# EAGLE design board (EAGLE 7.3.0)
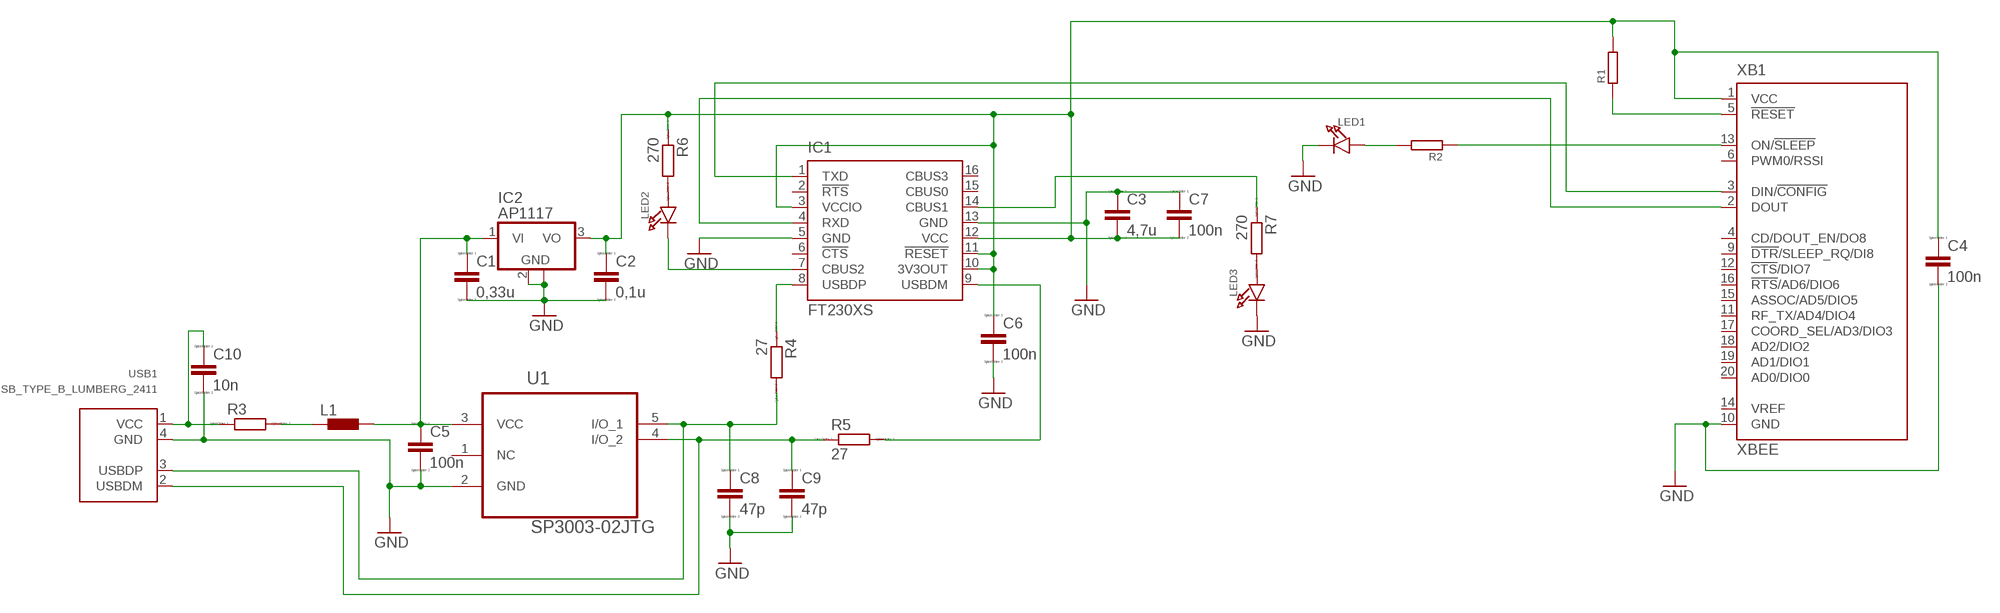
[diagram p0: schematic, sheet 1]

## Parts
C1  0,33u  C-EUC0805K  [C0805K]
C2  0,1u  C-EUC0805K  [C0805K]
C3  4,7u  C-EUC0805K  [C0805K]
C4  100n  C-EUC0805K  [C0805K]
C5  100n  C-EUC0805K  [C0805K]
C6  100n  C-EUC0805K  [C0805K]
C7  100n  C-EUC0805K  [C0805K]
C8  47p  C-EUC0805K  [C0805K]
C9  47p  C-EUC0805K  [C0805K]
C10  10n  C-EUC0805K  [C0805K]
IC1  FT230XS  [SSOP16]
IC2  AP1117  UA78M05DCY  [SOT223]
L1  BLM15HB121SN1  [0402]
LED1  LED1206  [CHIPLED_1206]
LED2  LED1206  [CHIPLED_1206]
LED3  LED1206  [CHIPLED_1206]
R1  RESISTOR_0805  [0805]
R2  RESISTOR_0805  [0805]
R3  RR1206  [R1206]
R4  27  RR1206  [R1206]
R5  27  RR1206  [R1206]
R6  270  RR1206  [R1206]
R7  270  RR1206  [R1206]
U1  SP3003-02JTG  [SOT65P220X110-5N]
USB1  USB_TYPE_B_LUMBERG_2411  [USB_TYPE_B_LUMBERG_2411]
XB1  XBEE  [XBEE]

## Nets
GND: C1.2 C2.2 C3.1 C4.2 C5.2 C6.2 C7.1 C8.2 C9.2 C10.2 IC1.5(GND) IC1.13(GND) IC2.2(GND) IC2.4(GND) LED1.C LED3.C U1.2(GND) USB1.4(GND) XB1.10(GND)
N$1: IC1.4(RXD) XB1.2(DOUT)
N$2: IC1.1(TXD) XB1.3(DIN/!CONFIG)
N$3: C1.1 C5.1 IC2.1(VI) L1.2 U1.3(VCC)
N$5: C10.1 R3.1 USB1.1(VCC)
N$6: R1.1 XB1.5(!RESET)
N$7: L1.1 R3.2
N$8: R2.1 XB1.13(ON/!SLEEP)
N$9: LED1.A R2.2
N$10: IC1.8(USBDP) R4.1
N$11: C8.1 R4.2 U1.5(I/O_1) USB1.3(USBDP)
N$12: C9.1 R5.1 U1.4(I/O_2) USB1.2(USBDM)
N$13: C2.1 C3.2 C4.1 C6.1 C7.2 IC1.3(VCCIO) IC1.10(3V3OUT) IC1.11(!RESET) IC1.12(VCC) IC2.3(VO) R1.2 R6.1 XB1.1(VCC)
N$14: IC1.9(USBDM) R5.2
N$15: LED2.A R6.2
N$16: IC1.7(CBUS2) LED2.C
N$17: IC1.14(CBUS1) R7.1
N$18: LED3.A R7.2
Unconnected: IC1.2(!RTS) IC1.6(!CTS) IC1.15(CBUS0) IC1.16(CBUS3) U1.1(NC) XB1.4(CD/DOUT_EN/DO8) XB1.6(PWM0/RSSI) XB1.9(!DTR!/SLEEP_RQ/DI8) XB1.11(RF_TX/AD4/DIO4) XB1.12(!CTS!/DIO7) XB1.14(VREF) XB1.15(ASSOC/AD5/DIO5) XB1.16(!RTS!/AD6/DIO6) XB1.17(COORD_SEL/AD3/DIO3) XB1.18(AD2/DIO2) XB1.19(AD1/DIO1) XB1.20(AD0/DIO0)

## Library data of the parts
C1-C10 = resistor:C-EU: CAPACITOR, European symbol; SPICEPREFIX: C
IC1 = ftdichip:FT230X: USB to BASIC UART IC Auto generated by make-symbol-device-package-bsdl.ulp Rev. 43 Source: Data sheet <http://www.ftdichip.com/Support/Documents/DataSheets/ICs/DS_FT230X.pdf>
IC2 = linear:UA78M*: POSITIVE-VOLTAGE REGULATORS Source: http://focus.ti.com/lit/ds/symlink/ua78m33.pdf
L1 = inductors:BLM15H: EMIFIL (R) Chip Ferrite Bead for GHz Noise Source: http://www.murata.com/ Ferrite Bead BLM15H.pdf
LED1-LED3 = microbuilder:LED: LED 0603 - 0603 Surface Mount Package 2mA: Green LED - Low Power (3.9mcd, 2ma, 1.7Vf) - Digikey: 475-2709-2-ND Orange LED - Low Power (9.8mcd, 2ma, 1.8Vf) - Digikey: 475-1194-2-ND Red LED - Low Power (5mcd, 2ma, 1.8Vf) - Digikey: 475-1195-2-ND Yellow LED - Low Power (7mcd, 2ma, 1.8Vf) - Digikey: 475-1196-2-ND 5mA: Blue LED - Low Power (17mcd, 5ma, 2.9Vf) - Digikey: LNJ937W8CRACT-ND 0805 - 0805 Surface Mount Package 2mA: Red LED (8.8mcd, 2mA, 1.8Vf, Clear) - Low Power [Digikey: 475-2510-1-ND] Green LED (5mcd, 2mA, 1.8Vf, Clear) - Low Power [Digikey: 475-2730-1-ND] Yellow LED (11.3mcd, 2mA, 1.8Vf, Clear) - Low Power [Digikey: 475-2555-1-ND] 20mA: Red LED (104mcd, 20mA, Diffused) - LS R976 [Digikey: 475-1278-6-ND] Red LED (12mcd, 20mA, 2.0Vf, Clear) - APT2012EC [Digikey: 754-1128-1-ND] Green LED (15mcd, 20mA, 2.2Vf, Clear) - APT2012GC [Digikey: 754-1131-1-ND] Orange LED (160mcd, 20mA, 2.1Vf, Clear) - APT2012SECK [Digikey: 754-1130-1-ND] 1206 - 1206 Surface Mount Package Green LED (26mcd, 20mA, Diffused) - LG N971 [Digikey: 475-1407-6-ND] Red LED (15mcd, 20mA, Diffused) - LH N974 [Digikey: 475-1416-6-ND]
R1 R2 = standard-sander:RESISTOR_0805
R3-R7 = eagle-ltspice:R: RESISTOR, European symbol; SPICEMODEL: NONE; SPICEPREFIX: R
U1 = matthijs:SP3003-02JTG: 0.65pF Rail Clamp Array; MPN: SP3003-02JTG; OC_FARNELL: 1827640; OC_NEWARK: 31T1604; PACKAGE: SC70-5; SUPPLIER: LITTELFUSE
USB1 = standard-sander:USB_TYPE_B_LUMBERG_2411: Farnell: 1177885
XB1 = maxstream:XBEE: XBee (TM) /XBee-PRO(TM) OEM RF Modules Source: MaxStream, Inc. xbee_productmanual.pdf; MPN: XBP24-Z7UIT-004; OC_FARNELL: 1751799; OC_NEWARK: 34R5507

## Board
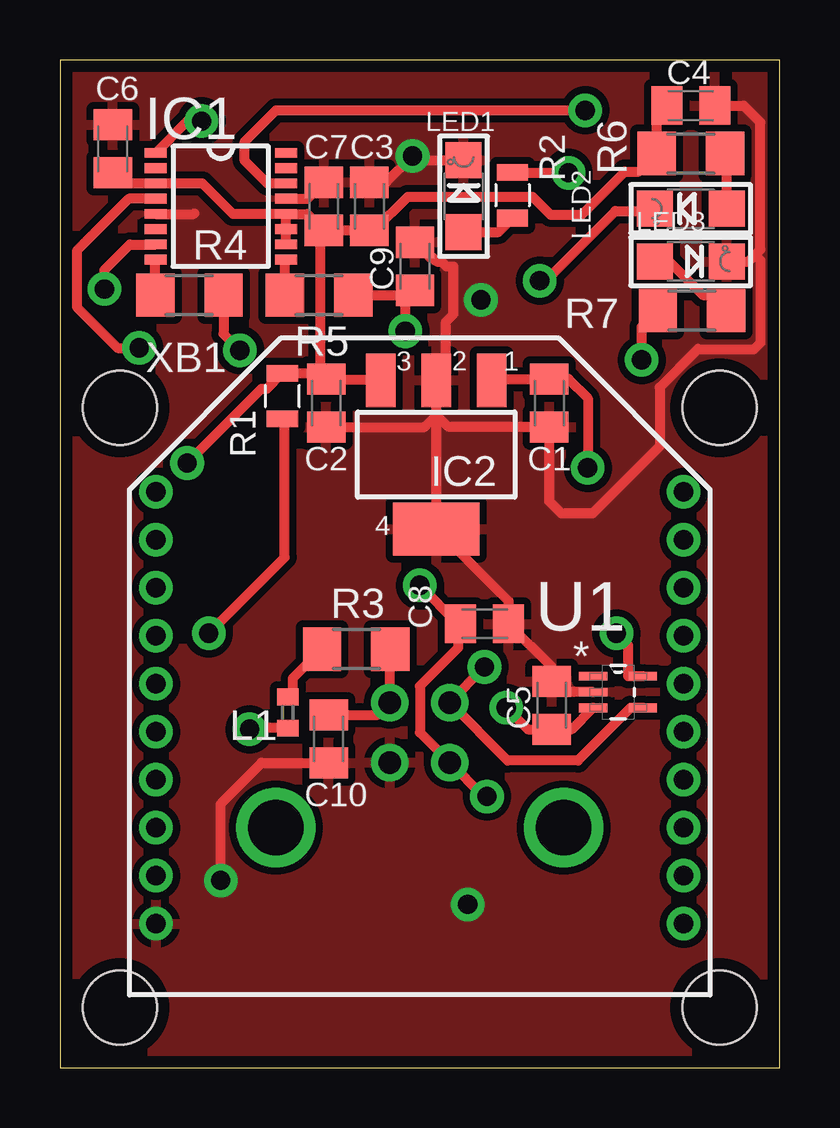
[diagram p1: board, top side]
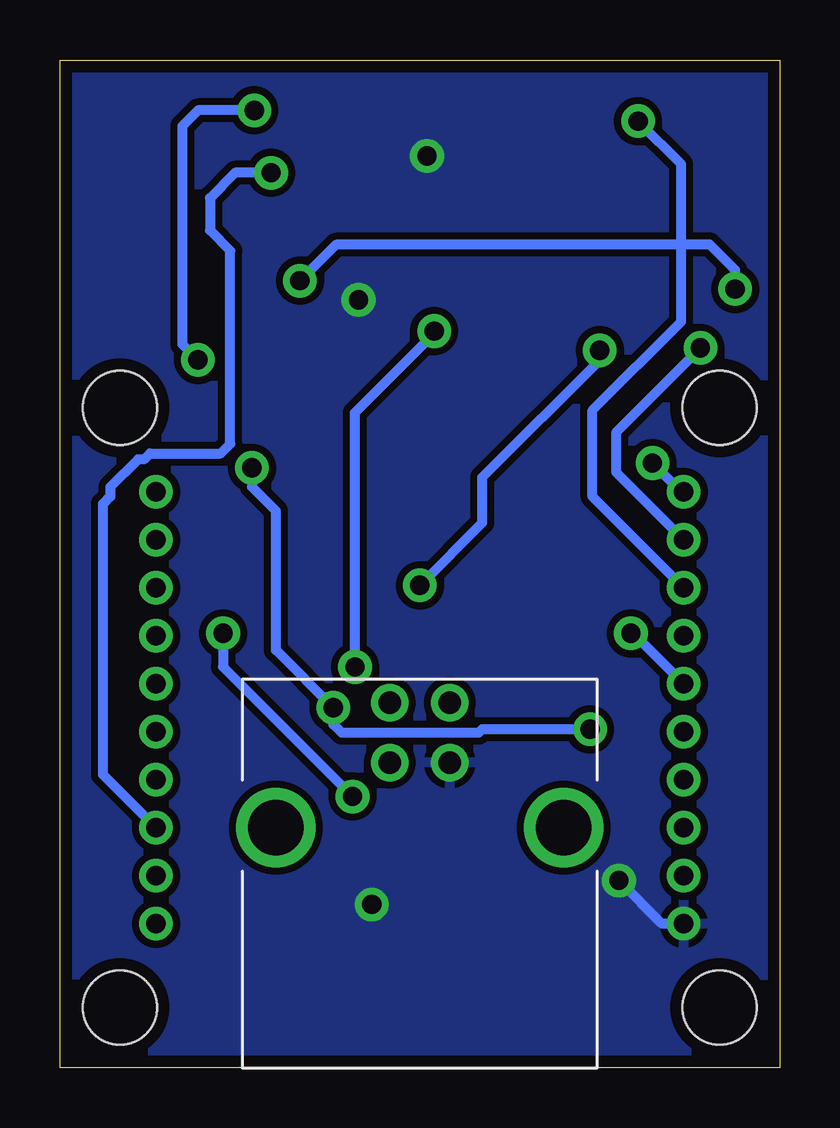
[diagram p2: board, bottom side, seen from below]

Size 30 x 42 mm. Coordinates in mm from the lower left corner, seen from the top.
Outline: 0,0 30,0 30,42 0,42 0,0
Copper layers (1*16): Top 0.035mm / dielectric 1.5mm / Bottom 0.035mm
Design rules "HVA-LPKF": minimum track width 0.3mm, minimum drill 0.6mm, track to track 0.3mm, track to pad 0.3mm, pad to pad 0.3mm, via to via 0.3mm, smd to smd 0.3mm, copper to edge 0.5mm, drill to drill 0.5mm, minimum pad ring 0.3mm, minimum via ring 0.3mm, stop-mask expansion 0.1mm, vias tented up to drill 0mil, thermal gap 0.3mm
Holes 3.1 mm at 2.5,27.5 27.5,27.5 27.5,2.5 2.5,2.5

### Footprints (pad centres in the part's own frame; a part is rotated, then mirrored left to right if it is on the bottom)
C0805K = smd 1.3 x 1.6: 1 -1,0; 2 1,0
SSOP16 = smd 0.914 x 0.406: 1 -2.718,2.223; 2 -2.718,1.587; 3 -2.718,0.953; 4 -2.718,0.318; 5 -2.718,-0.318; 6 -2.718,-0.953; 7 -2.718,-1.587; 8 -2.718,-2.223; 9 2.718,-2.223; 10 2.718,-1.587; 11 2.718,-0.953; 12 2.718,-0.318; 13 2.718,0.318; 14 2.718,0.953; 15 2.718,1.587; 16 2.718,2.223
SOT223 = smd 1.219 x 2.235: 1 -2.311,-3.099; 2 0,-3.099; 3 2.311,-3.099 | smd 3.6 x 2.2: 4 0,3.099
0402 = smd 0.7 x 0.9: 1 -0.65,0; 2 0.65,0
CHIPLED_1206 = smd 1.5 x 1.5: A 0,-1.496; C 0,1.496
0805 = smd 0.7 x 1.3: 1 0,0; 2 1.9,0
R1206 = smd 1.6 x 1.803: 1 -1.422,0; 2 1.422,0
SOT65P220X110-5N = smd 1.168 x 0.356: 1 -1.041,0.66; 2 -1.041,0; 3 -1.041,-0.66; 4 1.041,-0.66; 5 1.041,0.66
USB_TYPE_B_LUMBERG_2411 = drill 0.95: 1 1.25,5.21; 2 -1.25,5.21; 3 -1.25,2.71; 4 1.25,2.71 | drill 2.3: MOUNT@1 -6,0; MOUNT@2 6,0
XBEE = drill 0.8 pad 1.27: 1 -11,9; 2 -11,7; 3 -11,5; 4 -11,3; 5 -11,1; 6 -11,-1; 7 -11,-3; 8 -11,-5; 9 -11,-7; 10 -11,-9; 11 11,-9; 12 11,-7; 13 11,-5; 14 11,-3; 15 11,-1; 16 11,1; 17 11,3; 18 11,5; 19 11,7; 20 11,9

### Placement (x,y rotation side)
C1  20.4,27.7 270 top
C2  11.1,27.7 270 top
C3  12.9,35.9 270 top
C4  26.3,40.1 0 top
C5  20.5,15.1 90 top
C6  2.2,38.3 90 top
C7  11,35.9 270 top
C8  17.7,18.5 0 top
C9  14.8,33.4 90 top
C10  11.2,13.7 270 top
IC1  6.7,35.9 0 top
IC2  15.69,25.55 180 top
L1  9.5,14.8 270 top
LED1  16.83,36.32 0 top
LED2  26.3,35.8 90 top
LED3  26.3,33.6 270 top
R1  9.27,27.04 90 top
R2  18.87,37.31 270 top
R3  12.35,17.44 180 top
R4  5.4,32.2 0 top
R5  10.8,32.2 180 top
R6  26.3,38.1 0 top
R7  26.35,31.55 0 top
U1  23.27,15.65 0 top
USB1  15,10 0 bottom
XB1  15,15 0 top

### Tracks (layer width: path | path; a pad name or v marks a point on that pad's centre or on a via)
GND  (via drill 0.8, 0.8 pad 1.27)
  Top 0.406: 15.7,27.2 16.2,26.7 C1.2 20.4,23.6 20.9,23.1 22.2,23.1 25,25.9 25,28.35 26.6,29.95 28.95,29.95 29.2,30.2 29.2,33.65 28.98,33.88 | 15.7,27.2 15.7,28.64 IC2.2 16.1,29.06 16.1,31.1 16.4,31.4 16.4,33.4 16.1,33.4 15.9,33.6 15.7,33.6 15.5,33.8 15.4,33.8 C9.2 | C2.2 15.2,26.7 15.55,27.05 | 15.55,27.05 15.7,27.2 | 15.55,27.05 15.69,26.91 IC2.4 18.7,19.44 C8.2 20.5,16.7 C5.2 20.95,15.65 U1.2 | v6.7,7.8 6.7,11 8.4,12.7 C10.2 | 28.98,33.88 28.7,33.6 LED3.C 28.1,33.6 | 28.98,33.88 29.2,34.1 29.2,39.4 28.5,40.1 C4.2 | IC1.13 10.32,36.22 C7.1 | 5.6,35.6 5.58,35.58 IC1.5 | C3.1 13.6,36.9 v14.7,38 14.88,37.82 LED1.C
  Bottom 0.406: XB1.10 4.9,6 v6.7,7.8
  other vias: 17,6.8 17.55,32
  pour Bottom: 0,42 31,42 30,0 0,0
  pour Top: 0,42 30,42 30,0 0,0
N$1  (via drill 0.8)
  Top 0.406: IC1.4 2.87,36.22 0.7,34.05 0.7,31.7 2.4,30 v3.3,30
  Bottom 0.406: XB1.2 6.8,24.8 6.8,26.5 v3.3,30
N$2  (via drill 0.8)
  Top 0.406: IC1.1 5.31,39.45 v5.9,39.45
  Bottom 0.406: XB1.3 7.8,23.8 7.8,27.4 4.1,31.1 4.1,37.65 v5.9,39.45
N$3  (via drill 0.8 pad 1.27)
  Top 0.406: IC2.1 18.05,28.7 C1.1 21.2,28.7 22,27.9 v22,25 | L1.2 7.95,14.15 v7.9,14.1 | U1.3 21.34,14.1 C5.1 19.5,14.1 v18.6,15
  Bottom 0.406: v22,25 22,24.2 21,23.2 21,17.4 v18.6,15 18.6,14.3 18.25,13.95 12.55,13.95 12.4,14.1 v7.9,14.1
N$5
  Top 0.406: C10.1 13.24,14.7 USB1.1 13.75,17.42 R3.1
N$6  (via drill 0.8 pad 1.27)
  Top 0.406: v6.2,18.1 9.37,21.27 9.37,26.94 R1.1
  Bottom 0.406: v6.2,18.1 6.1,18.1 XB1.5
N$7
  Top 0.406: R3.2 9.7,16.21 9.7,15.65 L1.1
N$8  (via drill 0.8 pad 1.27)
  Top 0.406: R2.1 v21.19,37.31 v21.2,37.3
  Bottom 0.406: XB1.13 28.2,12.2 28.2,23.5 27.9,23.8 27.9,24.2 26.75,25.35 26.5,25.35 26.25,25.6 23.3,25.6 22.9,26 22.9,34.05 23.75,34.9 23.75,36.25 22.7,37.3 v21.2,37.3
N$9
  Top 0.406: LED1.A 18.28,34.82 R2.2
N$10
  Top 0.406: R4.1 IC1.8
N$11  (via drill 0.8 pad 1.27)
  Top 0.406: U1.5 23.69,16.31 23.69,17.61 v23.2,18.1 | R4.2 6.82,30.58 v7.5,29.9 | v17.8,11.3 17.66,11.3 USB1.3 15,13.96 15,15.9 16.6,17.5 16.6,18.5 | C8.1 16.6,18.5 | 16.6,18.5 v15,20.1
  Bottom 0.406: v7.5,29.9 7.5,29.5 12.4,24.6 12.4,22.7 v15,20.1 | v23.2,18.1 23.2,16.7 v17.8,11.3
N$12  (via drill 0.8 pad 1.27)
  Top 0.406: U1.4 23.79,14.99 21.6,12.8 18.66,12.8 USB1.2 16.25,15.25 v17.7,16.7 | R5.1 14.6,32.2 C9.1 14.4,32 v14.4,30.7
  Bottom 0.406: v17.7,16.7 17.7,27.3 14.4,30.6 v14.4,30.7
N$13  (via drill 0.8 pad 1.27)
  Top 0.406: 10.86,28.94 R1.2 8.63,28.3 8.4,28.3 v5.3,25.2 | 10.86,28.94 C2.1 11.15,28.65 IC2.3 | IC1.12 10.32,35.58 C7.2 | C4.1 24.88,39.68 R6.1 24.13,37.35 23.55,37.35 21.75,35.55 20.45,35.55 19.7,36.3 14.5,36.3 13.1,34.9 C3.2 C7.2 | 10.86,28.94 10.86,34.76 C7.2 | IC1.10 IC1.11 IC1.12 | IC1.12 7.22,35.58 5.95,36.85 IC1.3 2.65,36.85 C6.1
  Bottom 0.406: XB1.1 4.1,24 v5.3,25.2
N$14
  Top 0.406: R5.2 9.38,33.64 IC1.9
N$15
  Top 0.406: LED2.A 27.8,38.03 R6.2
N$16  (via drill 0.8)
  Top 0.406: LED2.C 24.7,35.7 23.15,35.7 20.25,32.8 v20,32.8 | IC1.7 2.91,34.31 1.85,33.25 v1.85,32.45
  Bottom 0.406: v1.85,32.45 1.85,33.25 2.91,34.31 2.92,34.3 18.5,34.3 v20,32.8
N$17  (via drill 0.8 pad 1.27)
  Top 0.406: IC1.14 8.65,36.85 7.7,37.8 7.7,38.6 9,39.9 v21.9,39.9 | v24.25,29.5 24.25,30.87 R7.1
  Bottom 0.406: v21.9,39.9 24.25,39.9 24.9,39.25 24.9,30.15 v24.25,29.5
N$18
  Top 0.406: LED3.A 25.4,33.6 26.8,32.2 27.2,32.2 28.2,31.2 28.12,31.2 R7.2